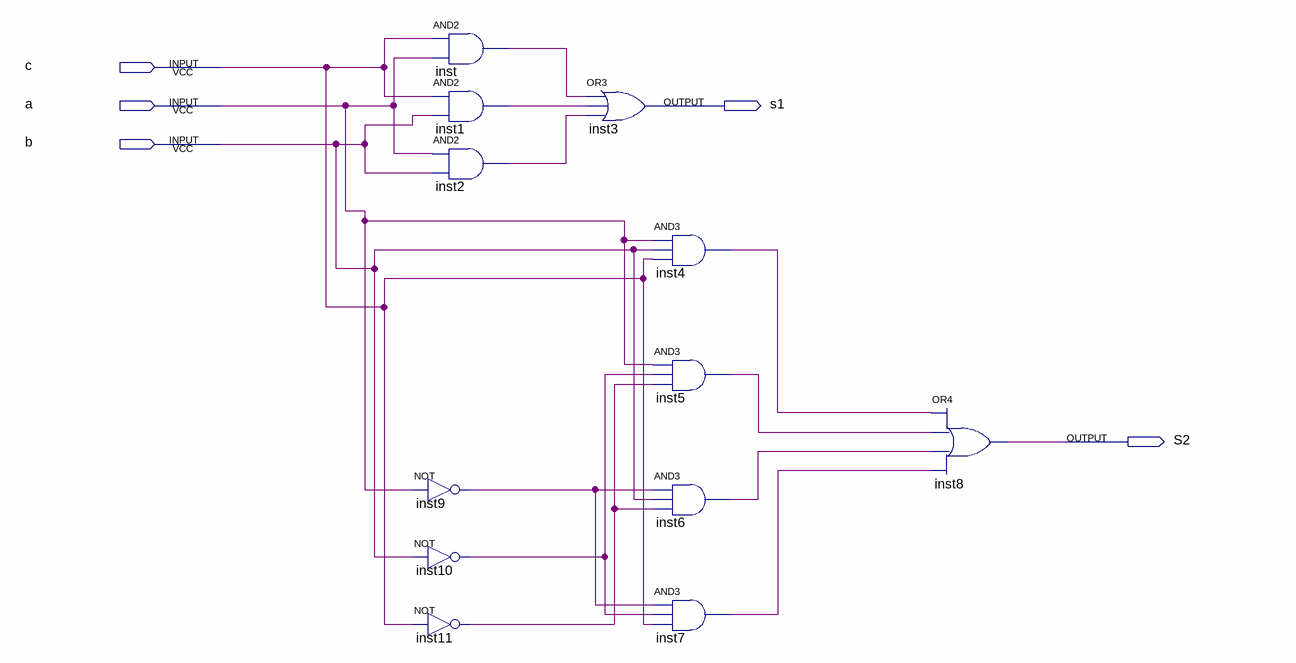
[diagram p0: schematic sheet]
// Quartus schematic Lab02.bdf as structural Verilog: 12 symbols, 5 pins
module Lab02 (
  input  c,
  input  a,
  input  b,
  output s1,
  output S2
);

  wire inst1_out, inst2_out, inst4_out, inst5_out, inst6_out, inst7_out, inst9_out, inst10_out, inst11_out,
       inst_out;

  and inst (inst_out, c, a);
  and inst1 (inst1_out, c, b);
  and inst2 (inst2_out, a, b);
  not inst9 (inst9_out, a);
  not inst10 (inst10_out, b);
  not inst11 (inst11_out, c);
  or inst3 (s1, inst_out, inst1_out, inst2_out);
  and inst4 (inst4_out, a, b, c);
  and inst5 (inst5_out, a, inst10_out, inst11_out);
  and inst6 (inst6_out, inst9_out, b, inst11_out);
  and inst7 (inst7_out, inst9_out, inst10_out, c);
  or inst8 (S2, inst4_out, inst5_out, inst6_out, inst7_out);
endmodule
